# EAGLE design LPC1343board (EAGLE 5.11)
PROJECT: LPC1343 Breakout Board v1.0
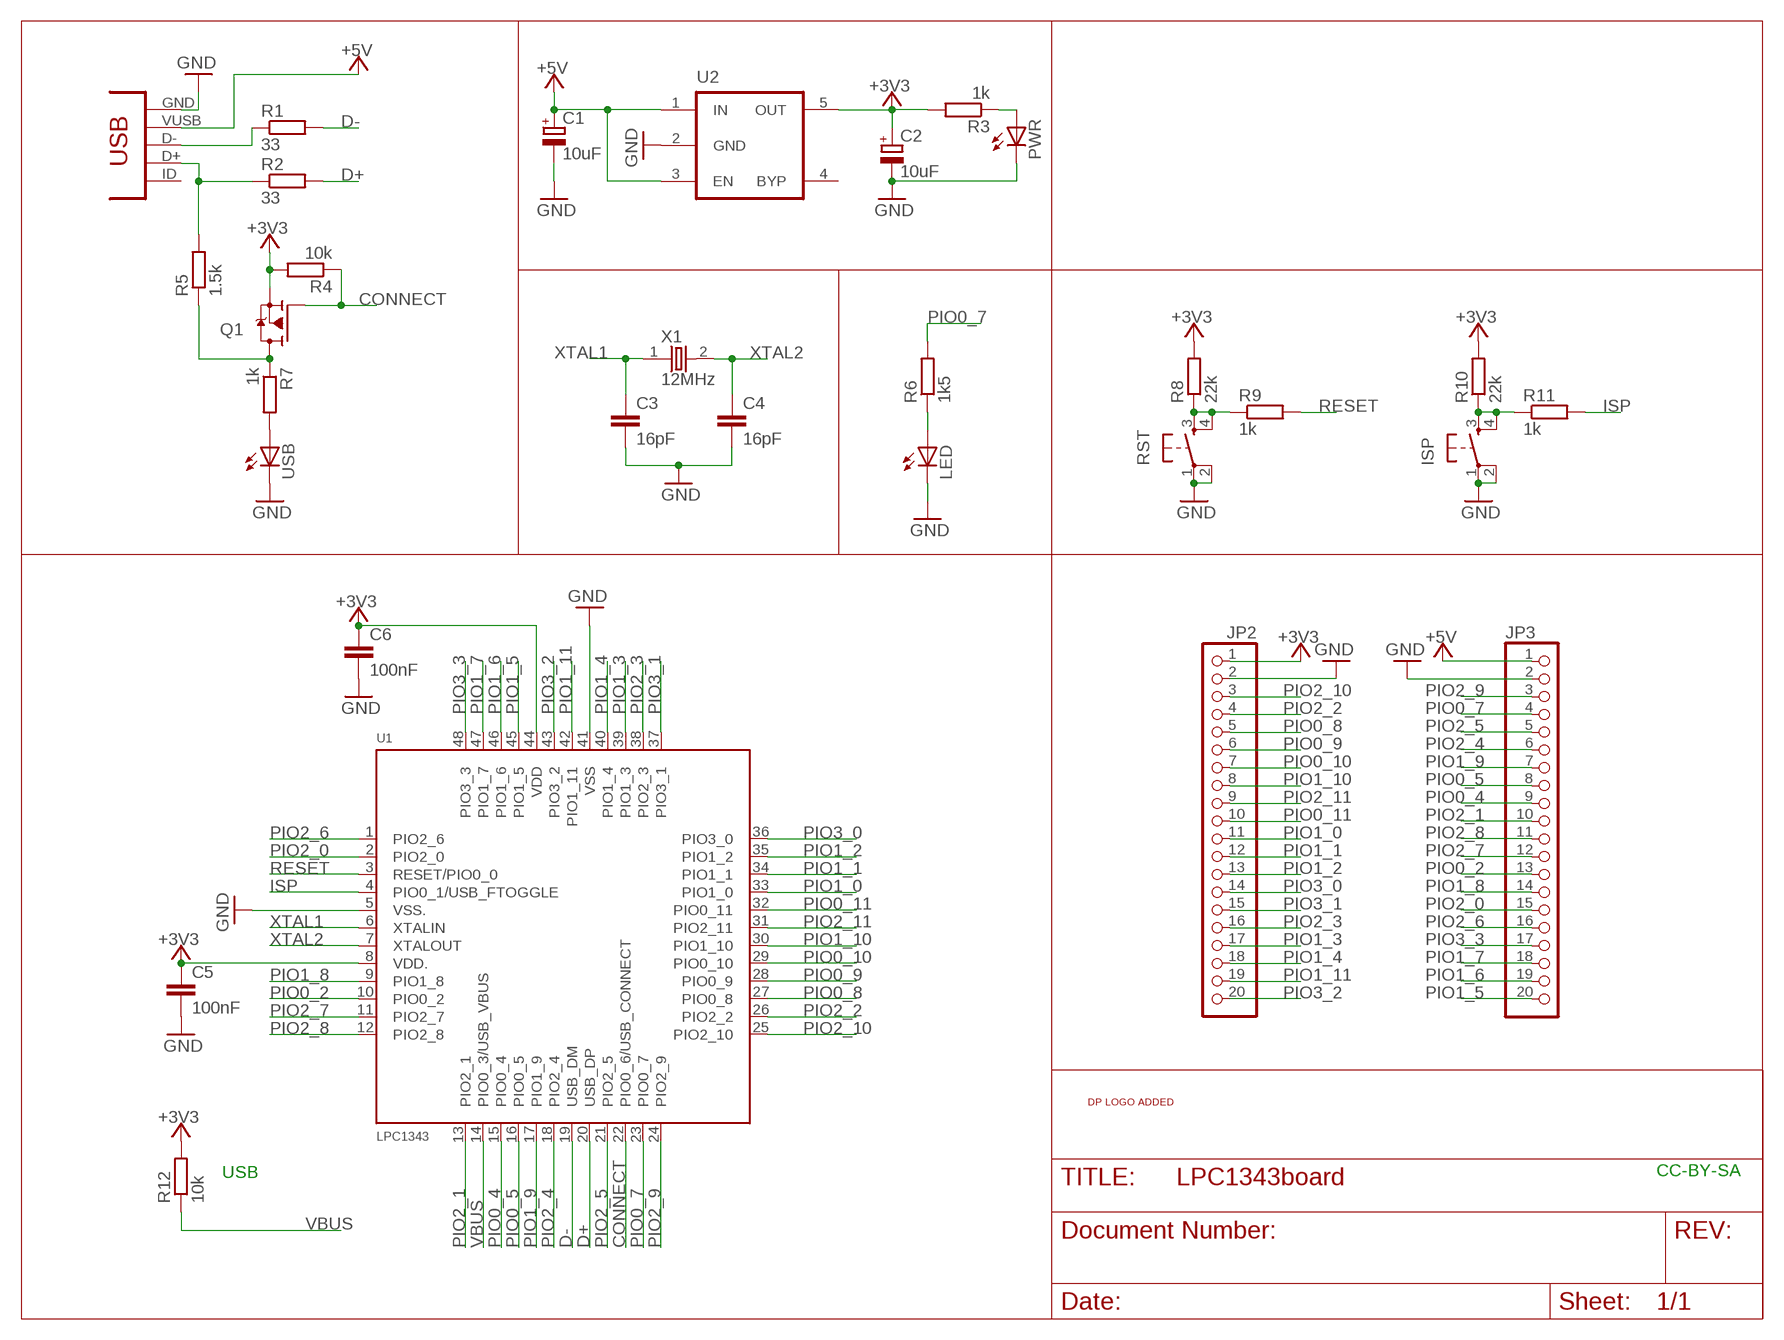
[diagram p0: schematic, sheet 1]

## Parts
C1  10uF  CAP_POLSMC_A  [SMC_A]
C2  10uF  CAP_POLSMC_A  [SMC_A]
C3  16pF  CAPC603  [C603]
C4  16pF  CAPC603  [C603]
C5  100nF  CAPC603  [C603]
C6  100nF  CAPC603  [C603]
ISP  SMD_TACT_SMALL  [TACT_SWITCH_SMALL]
J1  CON-USB-MINI-BUSB1  [CONN_USB_MINI-B]
JP2  PINHD-1X20  [1X20]
JP3  PINHD-1X20  [1X20]
LED  LED805  [LED-805]
PWR  LED805  [LED-805]
Q1  TSM2301CX  [SOT23]
R1  33  RESISTORR603  [R603]
R2  33  RESISTORR603  [R603]
R3  1k  RESISTORR603  [R603]
R4  10k  RESISTORR603  [R603]
R5  1.5k  RESISTORR603  [R603]
R6  1k5  RESISTORR603  [R603]
R7  1k  RESISTORR603  [R603]
R8  22k  RESISTORR603  [R603]
R9  1k  RESISTORR603  [R603]
R10  22k  RESISTORR603  [R603]
R11  1k  RESISTORR603  [R603]
R12  10k  RESISTORR603  [R603]
RST  SMD_TACT_SMALL  [TACT_SWITCH_SMALL]
U1  LPC1343  LPC1343FBD48  [LQFP48]
U2  MIC5205  [SOT-23-5]
U$3  DP_LOGO  [DP_LOGO]
USB  LED805  [LED-805]
X1  12MHz  CRYSTAL  [HC-49U]

## Nets
+3V3: C2.+ C5.1 C6.1 JP2.1 Q1.2(S) R3.2 R4.2 R8.2 R10.2 R12.2 U1.8(VDD.) U1.44(VDD) U2.5(OUT)
+5V: C1.+ J1.VUSB JP3.1 U2.1(IN) U2.3(EN)
CONNECT: Q1.1(G) R4.1 U1.22(PIO0_6/USB_CONNECT)
D+: R2.2 U1.20(USB_DP)
D-: R1.2 U1.19(USB_DM)
GND: C1.- C2.- C3.2 C4.2 C5.2 C6.2 ISP.1 ISP.2 J1.GND JP2.2 JP3.2 LED.C PWR.C RST.1 RST.2 U1.5(VSS.) U1.41(VSS) U2.2(GND) USB.C
ISP: R11.2 U1.4(PIO0_1/USB_FTOGGLE)
N$1: LED.A R6.1
N$2: J1.D- R1.1
N$3: J1.D+ R2.1 R5.2
N$4: PWR.A R3.1
N$5: R8.1 R9.1 RST.3 RST.4
N$6: Q1.3(D) R5.1 R7.1
N$7: R7.2 USB.A
N$8: ISP.3 ISP.4 R10.1 R11.1
PIO0_2: JP3.13 U1.10(PIO0_2)
PIO0_4: JP3.9 U1.15(PIO0_4)
PIO0_5: JP3.8 U1.16(PIO0_5)
PIO0_7: JP3.4 R6.2 U1.23(PIO0_7)
PIO0_8: JP2.5 U1.27(PIO0_8)
PIO0_9: JP2.6 U1.28(PIO0_9)
PIO0_10: JP2.7 U1.29(PIO0_10)
PIO0_11: JP2.10 U1.32(PIO0_11)
PIO1_0: JP2.11 U1.33(PIO1_0)
PIO1_1: JP2.12 U1.34(PIO1_1)
PIO1_2: JP2.13 U1.35(PIO1_2)
PIO1_3: JP2.17 U1.39(PIO1_3)
PIO1_4: JP2.18 U1.40(PIO1_4)
PIO1_5: JP3.20 U1.45(PIO1_5)
PIO1_6: JP3.19 U1.46(PIO1_6)
PIO1_7: JP3.18 U1.47(PIO1_7)
PIO1_8: JP3.14 U1.9(PIO1_8)
PIO1_9: JP3.7 U1.17(PIO1_9)
PIO1_10: JP2.8 U1.30(PIO1_10)
PIO1_11: JP2.19 U1.42(PIO1_11)
PIO2_0: JP3.15 U1.2(PIO2_0)
PIO2_1: JP3.10 U1.13(PIO2_1)
PIO2_2: JP2.4 U1.26(PIO2_2)
PIO2_3: JP2.16 U1.38(PIO2_3)
PIO2_4: JP3.6 U1.18(PIO2_4)
PIO2_5: JP3.5 U1.21(PIO2_5)
PIO2_6: JP3.16 U1.1(PIO2_6)
PIO2_7: JP3.12 U1.11(PIO2_7)
PIO2_8: JP3.11 U1.12(PIO2_8)
PIO2_9: JP3.3 U1.24(PIO2_9)
PIO2_10: JP2.3 U1.25(PIO2_10)
PIO2_11: JP2.9 U1.31(PIO2_11)
PIO3_0: JP2.14 U1.36(PIO3_0)
PIO3_1: JP2.15 U1.37(PIO3_1)
PIO3_2: JP2.20 U1.43(PIO3_2)
PIO3_3: JP3.17 U1.48(PIO3_3)
RESET: R9.2 U1.3(RESET/PIO0_0)
VBUS: R12.1 U1.14(PIO0_3/USB_VBUS)
XTAL1: C3.1 U1.6(XTALIN) X1.1
XTAL2: C4.1 U1.7(XTALOUT) X1.2
Unconnected: J1.BODY@1(BODY) J1.BODY@2(BODY) J1.BODY@3(BODY) J1.BODY@4(BODY) J1.ID(USBID) U2.4(BYP)

## Notes on the sheet
- USB | CC-BY-SA

## Library data of the parts
C1 C2 = dp_devices:CAP_POL
C3-C6 = dp_devices:CAP
ISP RST = dp_devices:SMD_TACT_SMALL
J1 = dp_devices:CON-USB-MINI-B: USB connector
JP2 JP3 = pinhead:PINHD-1X20: PIN HEADER
LED PWR USB = dp_devices:LED
Q1 = dp_devices:TSM2301CX: 20V P-Channel Enhancement Mode MOSFET
R1-R12 = dp_devices:RESISTOR
U1 = dp_devices:LPC1343
U2 = dp_devices:MIC5205: 150ma Low-Noise LDO Regulator
U$3 = dp_devices:DP_LOGO; FF1: fullfillment by; FF2: Seeed studio; FF3: www.seeedstudio.com; LICENSE: CC-BY-SA; PROJECT: project; URL1: http://; URL2: DangerousPrototypes.com
X1 = dp_devices:CRYSTAL

## Board
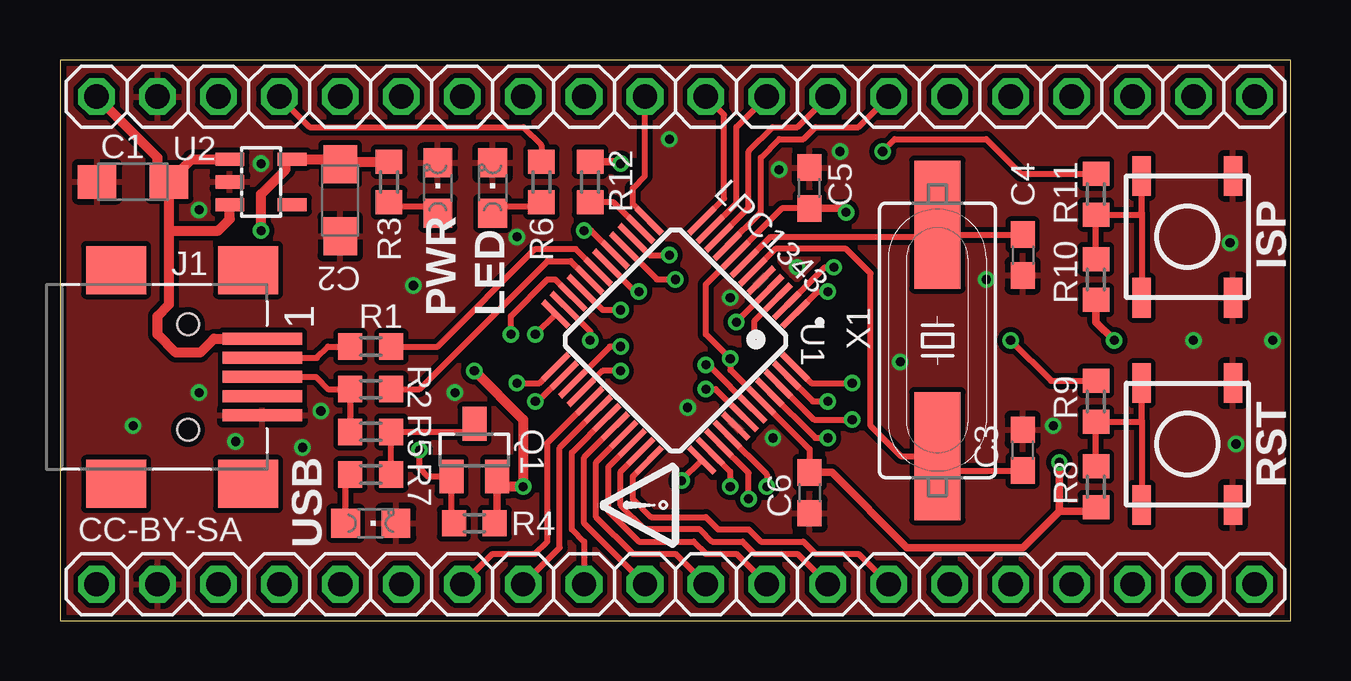
[diagram p1: board, top side]
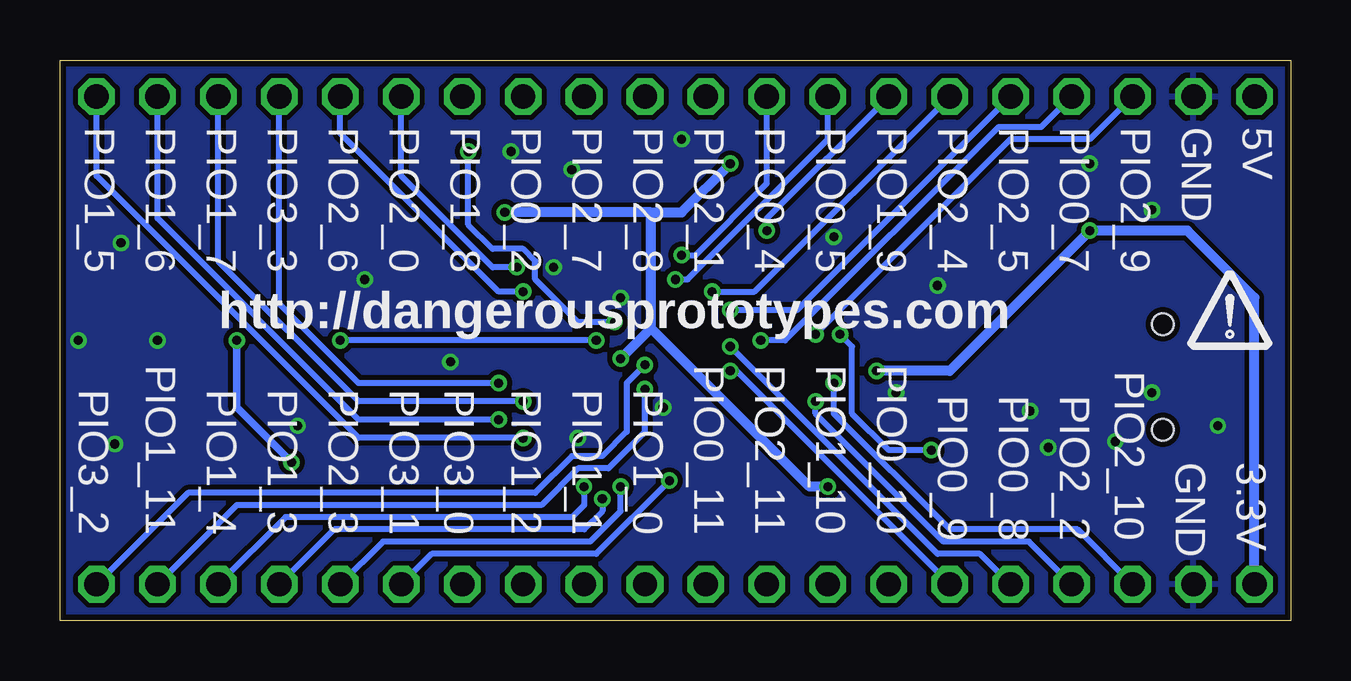
[diagram p2: board, bottom side, seen from below]

Size 51.31 x 23.37 mm. Coordinates in mm from the lower left corner, seen from the top.
Outline: 0,0 51.31,0 51.31,23.37 0,23.37 0,0
Copper layers (1*16): Top 0.035mm / dielectric 1.5mm / Bottom 0.035mm
Design rules "Fusion_eagle_rule_v1.1": minimum track width 6mil, minimum drill 12mil, track to track 6mil, track to pad 6mil, pad to pad 6mil, via to via 6mil, smd to smd 0mil, copper to edge 10mil, drill to drill 10mil, minimum pad ring 10mil, minimum via ring 6mil, stop-mask expansion 2mil, vias tented up to drill 100mil, thermal gap 10mil

### Footprints (pad centres in the part's own frame; a part is rotated, then mirrored left to right if it is on the bottom)
SMC_A = smd 1.6 x 1.4: + -1.5,0; - 1.5,0
C603 = smd 1.1 x 1: 1 -0.85,0; 2 0.85,0
TACT_SWITCH_SMALL = smd 1.651 x 0.762: 1 -2.54,1.905; 2 2.54,1.905; 3 -2.54,-1.905; 4 2.54,-1.905
CONN_USB_MINI-B = smd 2 x 2.5: BODY@1 -4.45,2.5; BODY@2 4.45,2.5; BODY@3 4.45,-3; BODY@4 -4.45,-3 | smd 0.5 x 3.3: D+ 0,3.1; D- -0.8,3.1; GND 1.6,3.1; ID 0.8,3.1; VUSB -1.6,3.1 | hole 0.9: -2.2,0; 2.2,0
1X20 = drill 1.016 octagon: 1 -24.13,0; 2 -21.59,0; 3 -19.05,0; 4 -16.51,0; 5 -13.97,0; 6 -11.43,0; 7 -8.89,0; 8 -6.35,0; 9 -3.81,0; 10 -1.27,0; 11 1.27,0; 12 3.81,0; 13 6.35,0; 14 8.89,0; 15 11.43,0; 16 13.97,0; 17 16.51,0; 18 19.05,0; 19 21.59,0; 20 24.13,0
LED-805 = smd 1.2 x 1.2: A 0,-1.05; C 0,1.05
SOT23 = smd 1 x 1.4: 1 -0.95,-1.1; 2 0.95,-1.1; 3 0,1.1
R603 = smd 1 x 1.1: 1 -0.85,0; 2 0.85,0
LQFP48 = smd 1.5 x 0.25: 1 -4.3,2.75; 2 -4.3,2.25; 3 -4.3,1.75; 4 -4.3,1.25; 5 -4.3,0.75; 6 -4.3,0.25; 7 -4.3,-0.25; 8 -4.3,-0.75; 9 -4.3,-1.25; 10 -4.3,-1.75; 11 -4.3,-2.25; 12 -4.3,-2.75; 25 4.3,-2.75; 26 4.3,-2.25; 27 4.3,-1.75; 28 4.3,-1.25; 29 4.3,-0.75; 30 4.3,-0.25; 31 4.3,0.25; 32 4.3,0.75; 33 4.3,1.25; 34 4.3,1.75; 35 4.3,2.25; 36 4.3,2.75 | smd 0.25 x 1.5: 13 -2.75,-4.3; 14 -2.25,-4.3; 15 -1.75,-4.3; 16 -1.25,-4.3; 17 -0.75,-4.3; 18 -0.25,-4.3; 19 0.25,-4.3; 20 0.75,-4.3; 21 1.25,-4.3; 22 1.75,-4.3; 23 2.25,-4.3; 24 2.75,-4.3; 37 2.75,4.3; 38 2.25,4.3; 39 1.75,4.3; 40 1.25,4.3; 41 0.75,4.3; 42 0.25,4.3; 43 -0.25,4.3; 44 -0.75,4.3; 45 -1.25,4.3; 46 -1.75,4.3; 47 -2.25,4.3; 48 -2.75,4.3
SOT-23-5 = smd 0.55 x 1.2: 1 -0.95,-1.3; 2 0,-1.3; 3 0.95,-1.3; 4 0.95,1.3; 5 -0.95,1.3
HC-49U = smd 5.334 x 1.93: 1 -4.826,0; 2 4.826,0

### Placement (x,y rotation side)
C1  3.05,18.29 180 top
C2  11.68,17.53 270 top
C3  40.13,7.11 90 top
C4  40.13,15.24 270 top
C5  31.24,18.03 90 top
C6  31.24,5.33 270 top
ISP  46.99,16 270 top
J1  5.33,10.16 270 top
JP2  25.65,1.52 0 top
JP3  25.65,21.84 0 top
LED  18.03,18.03 0 top
PWR  15.75,18.03 0 top
Q1  17.27,7.11 0 top
R1  12.95,11.43 0 top
R2  12.95,9.65 0 top
R3  13.72,18.29 90 top
R4  17.27,4.06 0 top
R5  12.95,7.87 180 top
R6  20.07,18.29 90 top
R7  12.95,6.1 180 top
R8  43.18,5.59 270 top
R9  43.18,9.14 90 top
R10  43.18,14.22 270 top
R11  43.18,17.78 90 top
R12  22.1,18.29 90 top
RST  46.99,7.37 270 top
U1  25.65,11.68 225 top
U2  8.38,18.29 270 top
U$1  [DP_LOGO]  25.15,4.83 90 top
U$2  [DP_LOGO]  2.54,11.94 0 bottom
U$3  55.63,10.92 0 top  (outside the outline)
USB  12.95,4.06 270 top
X1  36.58,11.68 90 top

### Tracks (layer width: path | path; a pad name or v marks a point on that pad's centre or on a via)
+3V3  (via drill 0.38)
  Top 0.254: C6.1 31.24,7.16 U1.44 27.94,10.46 v27.94,10.92 26.92,11.94 26.92,14.02 U1.8 30.09,17.18 C5.1
  Top 0.305: C6.1 32.17,6.18 35.31,3.05 40.13,3.05 41.66,4.57 | Q1.2 18.22,4.16 R4.2 | R10.2 43.18,12.45 v43.94,11.68 | 41.66,4.57 43.01,4.57 R8.2 | 41.66,4.57 v41.66,6.6 | v32.77,17.02 32.6,17.18 C5.1 | R12.2 23.28,19.14 v23.37,19.05 | U2.5 9.62,19.3 9.4,19.3
  Top 0.406: U2.5 11.47,19.24 C2.+ 11.8,19.14 R3.2 | v8.38,16.26 8.38,17.78 9.4,18.8 9.4,19.3 | v17.27,10.41 19.3,8.38 v19.3,5.59 18.39,5.59 Q1.2
  Bottom 0.305: v43.94,11.68 43.94,8.89 v41.66,6.6
  Bottom 0.406: v19.3,5.59 20.07,5.59 26.67,12.19 | v23.37,19.05 25.4,17.02 26.67,17.02 | 26.67,17.02 v32.77,17.02 | 26.67,12.19 26.67,17.02 | 26.67,12.19 v27.94,10.92 | JP2.1 1.52,13.46 4.32,16.26 v8.38,16.26 14.22,10.41 v17.27,10.41
+5V
  Top 0.406: U2.1 5.5,19.24 C1.+ | 4.55,16.26 4.55,13.18 4.06,12.7 4.06,11.94 4.83,11.18 5.84,11.18 6.43,11.76 J1.VUSB | 4.55,16.26 C1.+ | U2.3 7.08,16.73 6.6,16.26 4.55,16.26 | C1.+ 4.06,18.77 4.06,19.3 JP3.1
CONNECT  (via drill 0.38)
  Top 0.254: U1.22 20.64,14.22 20.32,14.22 18.8,12.7 v18.8,11.94 | R4.1 16.32,4.16 Q1.1 15.32,6.01 14.99,6.35 v14.99,7.11
  Bottom 0.254: v18.8,11.94 18.29,11.43 18.29,8.64 16.76,7.11 v14.99,7.11
D+
  Top 0.254: R2.2 14.99,9.65 20.32,14.99 21.29,14.99 U1.20
D-
  Top 0.254: R1.2 15.75,11.43 19.81,15.49 21.49,15.49 U1.19
GND  (via drill 0.38)
  other vias: 5.8,17.13 8.38,19.05 26.16,8.89 29.72,7.62 30.73,14.73 27.94,13.46 41.4,8.13 38.61,14.22 49.02,7.37 29.97,18.8 32.51,19.56 10.88,8.74 10.11,7.22 7.32,7.47 5.8,9.51 48.77,15.75 47.24,11.68 35.03,10.79 16.46,9.51 14.73,13.97 19.05,16 25.4,20.07 3.05,8.13 50.55,11.68
  pour Top (isolate 0.203): 0,0 51.31,0 51.31,23.37 0,23.37
  pour Bottom (isolate 0.203): 0,0 51.31,0 51.31,23.37 0,23.37
ISP  (via drill 0.38)
  Top 0.254: R11.2 40.04,18.63 38.61,20.07 34.8,20.07 v34.29,19.56 | v28.19,12.45 28.19,12.46 U1.4
  Bottom 0.254: v28.19,12.45 29.72,12.45 31.5,14.22 31.5,14.99 32,15.49 33.27,15.49 34.29,16.51 v34.29,19.56
N$1
  Top 0.254: LED.A 18.03,17.27 19.9,17.27 R6.1
N$2
  Top 0.254: J1.D- 10.71,10.96 11.18,11.43 R1.1
N$3
  Top 0.254: J1.D+ 10.67,10.16 11.18,9.65 R2.1 R5.2
N$4
  Top 0.254: PWR.A 15.75,17.27 13.88,17.27 R3.1
N$5
  Top 0.254: 45.09,8.38 RST.4 | 45.09,8.38 RST.3 | R8.1 R9.1 45,8.29 45.09,8.38
N$6
  Top 0.254: Q1.3 17.19,7.87 R5.1 R7.1
N$7
  Top 0.254: USB.A 11.9,5.9 R7.2
N$8
  Top 0.254: R10.1 R11.1 45,16.93 45.09,17.02 | 45.09,17.02 ISP.4 | 45.09,17.02 ISP.3
PIO0_2
  Top 0.254: U1.10 28.7,17.21 28.7,19.56 29.72,20.57 30.73,20.57 JP3.13
PIO0_4  (via drill 0.38)
  Top 0.254: U1.15 24.57,15.24 v25.4,15.24
  Bottom 0.254: JP3.9 21.84,18.22 24.83,15.24 v25.4,15.24
PIO0_5  (via drill 0.38)
  Top 0.254: U1.16 24.88,14.22 v25.65,14.22
  Bottom 0.254: JP3.8 19.3,20.07 25.15,14.22 v25.65,14.22
PIO0_7  (via drill 0.38)
  Top 0.254: U1.23 22.1,12.06 v22.1,11.68 | R6.2 20.07,19.81 19.3,20.57 10.41,20.57 JP3.4
  Bottom 0.254: v22.1,11.68 21.08,11.68 12.19,20.57 10.41,20.57 JP3.4
PIO0_8  (via drill 0.38)
  Top 0.254: U1.27 22.92,11.43 v23.37,11.43
  Bottom 0.254: JP2.5 12.95,2.79 14.73,2.79 v23.37,11.43
PIO0_9  (via drill 0.38)
  Top 0.254: U1.28 22.62,10.41 v23.37,10.41
  Bottom 0.254: v23.37,10.41 23.11,10.41 JP2.6
PIO0_10
  Top 0.254: U1.29 20.32,7.41 20.32,3.3 19.81,2.79 18.03,2.79 JP2.7
PIO0_11
  Top 0.254: U1.32 21.84,6.81 21.84,4.06 JP2.10
PIO1_0
  Top 0.254: U1.33 22.35,6.61 22.35,4.32 23.88,2.79 25.65,2.79 JP2.11
PIO1_1
  Top 0.254: U1.34 22.86,6.42 22.86,4.57 24.13,3.3 26.42,3.3 26.92,2.79 28.19,2.79 JP2.12
PIO1_2
  Top 0.254: JP2.13 30.73,2.79 28.96,2.79 28.45,3.3 27.18,3.3 26.67,3.81 24.38,3.81 23.37,4.83 23.37,6.22 U1.35
PIO1_3  (via drill 0.38)
  Top 0.254: U1.39 28.7,6.16 v28.7,5.08
  Bottom 0.254: v28.7,5.08 28.7,4.57 29.46,3.81 39.88,3.81 JP2.17
PIO1_4  (via drill 0.38)
  Top 0.254: U1.40 29.46,6.11 v29.46,5.59
  Bottom 0.254: v29.46,5.59 29.46,4.83 29.97,4.32 41.91,4.32 JP2.18
PIO1_5  (via drill 0.38)
  Top 0.254: U1.45 31.49,7.62 v32,7.62
  Bottom 0.254: v32,7.62 38.86,7.62 49.78,18.54 JP3.20
PIO1_6  (via drill 0.38)
  Top 0.254: U1.46 31.43,8.38 v33.02,8.38
  Bottom 0.254: v33.02,8.38 38.86,8.38 47.24,16.76 JP3.19
PIO1_7  (via drill 0.38)
  Top 0.254: U1.47 31.38,9.14 v32,9.14
  Bottom 0.254: v32,9.14 38.86,9.14 44.7,14.99 JP3.18
PIO1_8
  Top 0.254: U1.9 27.81,15.62 29.21,17.02 29.21,19.3 29.97,20.07 30.99,20.07 31.5,20.57 33.27,20.57 JP3.14
PIO1_9  (via drill 0.38)
  Top 0.254: U1.17 22.14,16.26 v21.84,16.26
  Bottom 0.254: v21.84,16.26 21.84,16.76 JP3.7
PIO1_10
  Top 0.254: U1.30 20.83,7.21 20.83,3.05 JP2.8
PIO1_11  (via drill 0.38)
  Top 0.254: U1.42 27.33,9.65 v26.92,9.65
  Bottom 0.254: v26.92,9.65 26.92,7.87 28.45,6.35 29.72,6.35 31.24,4.83 43.94,4.83 JP2.19
PIO2_0  (via drill 0.38)
  Top 0.254: U1.2 31.88,14.73 v32.26,14.73
  Bottom 0.254: v32.26,14.73 33.27,14.73 37.08,18.54 JP3.15
PIO2_1
  Top 0.254: U1.13 23.88,17.35 23.88,18.03 24.38,18.54 JP3.10
PIO2_2  (via drill 0.38)
  Top 0.254: U1.26 19.93,9.14 v19.81,9.14
  Bottom 0.254: JP2.4 10.92,3.3 14.48,3.3 19.81,8.64 v19.81,9.14
PIO2_3  (via drill 0.38)
  Top 0.254: U1.38 27.94,6.22 v27.94,5.59
  Bottom 0.254: JP2.16 37.85,3.3 29.21,3.3 27.94,4.57 v27.94,5.59
PIO2_4  (via drill 0.38)
  Top 0.254: U1.18 23.98,13.72 v24.13,13.72
  Bottom 0.254: v24.13,13.72 22.35,13.72 JP3.6
PIO2_5  (via drill 0.38)
  Top 0.254: U1.21 22.62,12.95 v23.37,12.95
  Bottom 0.254: v23.37,12.95 20.57,12.95 JP3.5
PIO2_6  (via drill 0.38)
  Top 0.254: U1.1 31.58,13.72 v32,13.72
  Bottom 0.254: v32,13.72 33.02,13.72 39.62,20.32 JP3.16
PIO2_7
  Top 0.254: U1.11 28.19,17.41 28.19,20.57 JP3.12
PIO2_8
  Top 0.254: U1.12 27.69,17.6 27.69,21.08 JP3.11
PIO2_9  (via drill 0.38)
  Top 0.254: U1.24 19.83,11.94 v19.81,11.94
  Bottom 0.254: v19.81,11.94 11.68,20.07 8.38,20.07 JP3.3
PIO2_10  (via drill 0.38)
  Top 0.254: U1.25 19.99,9.91 v19.05,9.91
  Bottom 0.254: JP2.3 8.89,3.81 14.22,3.81 19.05,8.64 v19.05,9.91
PIO2_11
  Top 0.254: U1.31 21.34,7.01 21.34,3.81 21.84,3.3 JP2.9
PIO3_0
  Top 0.254: U1.36 23.88,6.02 23.88,5.08 24.64,4.32 26.92,4.32 27.43,3.81 28.7,3.81 29.21,3.3 30.99,3.3 31.5,2.79 33.27,2.79 JP2.14
PIO3_1  (via drill 0.38)
  Top 0.254: U1.37 25.91,5.86 v25.91,5.84
  Bottom 0.254: v25.91,5.84 28.96,2.79 35.81,2.79 JP2.15
PIO3_2  (via drill 0.38)
  Top 0.254: U1.43 27.02,10.67 v26.92,10.67
  Bottom 0.254: JP2.20 45.97,5.33 31.5,5.33 29.97,6.86 28.7,6.86 27.69,7.87 27.69,9.91 v26.92,10.67
PIO3_3  (via drill 0.38)
  Top 0.254: U1.48 31.32,9.91 v33.02,9.91
  Bottom 0.254: v33.02,9.91 38.86,9.91 42.16,13.21 JP3.17
RESET  (via drill 0.38)
  Top 0.254: v28.96,11.68 28.96,12.51 U1.3 | v39.62,11.68 41.31,9.99 R9.2
  Bottom 0.254: v28.96,11.68 v39.62,11.68
VBUS
  Top 0.254: R12.1 23.08,17.44 U1.14
XTAL1
  Top 0.254: U1.6 29.82,15.49 32.77,15.49 33.78,14.48 33.78,8.13 35.05,6.86 X1.1 37.17,6.26 C3.1
XTAL2
  Top 0.254: C4.1 37,16.09 X1.2 36.58,16 29.62,16 U1.7

### Text on the board
tPlace: LPC1343 | CC-BY-SA
bNames: 5V | GND | PIO2_9 | PIO0_7 | PIO2_5 | PIO2_4 | PIO1_9 | PIO0_5 | PIO0_4 | PIO2_1 | PIO2_8 | PIO2_7 | PIO0_2 | PIO1_8 | PIO2_0 | PIO2_6 | PIO3_3 | PIO1_7 | PIO1_6 | PIO1_5 | http://dangerousprototypes.com | PIO0_10 | PIO1_10 | PIO2_11 | PIO0_11 | PIO1_11 | PIO2_10 | PIO1_0 | PIO1_1 | PIO1_2 | PIO3_0 | PIO3_1 | PIO2_3 | PIO1_3 | PIO1_4 | PIO3_2 | PIO2_2 | PIO0_8 | PIO0_9 | 3.3V | GND